# EAGLE design btn_0.3 (EAGLE 6.3)
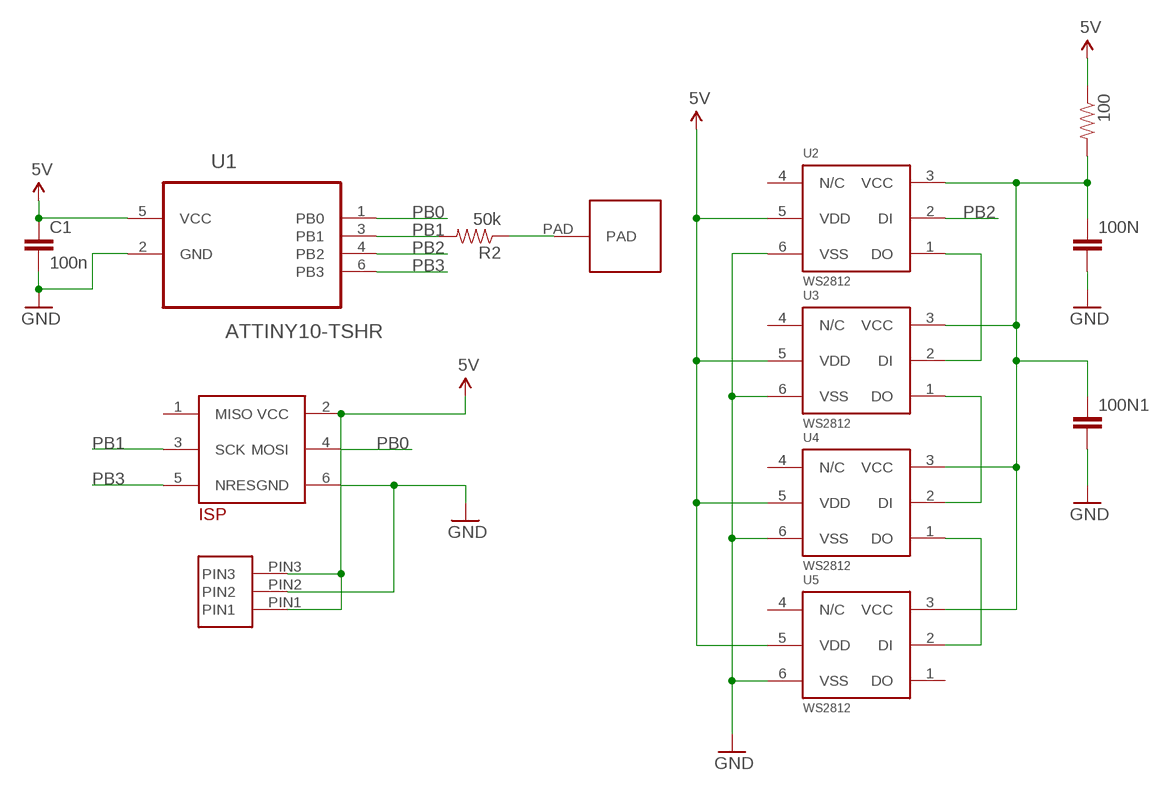
[diagram p0: schematic, sheet 1]

## Parts
100  RESISTOR0805-RES  [0805]
100N  CAP0805  [0805]
100N1  CAP0805  [0805]
C1  100n  CAP0805  [0805]
R2  50k  RESISTOR0805-RES  [0805]
U1  ATTINY10-TSHR  [SOT95P280X145-6N]
U2  WS2812  [PLCC6]
U3  WS2812  [PLCC6]
U4  WS2812  [PLCC6]
U5  WS2812  [PLCC6]
U$1  TB_ISPEDGE_2X3  [ISP_EDGE2X3]
U$2  TB_TOUCH_0.5INCH  [TOUCH_ROUND0.5INCH]
U$4  TB_EDGE3  [TB_EDGE3]

## Nets
5V [Power]: 100.1 C1.1 U1.5(VCC) U2.5(VDD) U3.5(VDD) U4.5(VDD) U5.5(VDD) U$1.2(VCC) U$4.PIN1 U$4.PIN3
GND [Power]: 100N1.2 100N.2 C1.2 U1.2(GND) U2.6(VSS) U3.6(VSS) U4.6(VSS) U5.6(VSS) U$1.6(GND) U$4.PIN2
N$1: R2.1 U$2.PAD
N$5: U2.1(DO) U3.2(DI)
N$6: U3.1(DO) U4.2(DI)
N$7: U4.1(DO) U5.2(DI)
N$8: 100.2 100N1.1 100N.1 U2.3(VCC) U3.3(VCC) U4.3(VCC) U5.3(VCC)
PB0: U1.1(PB0) U$1.4(MOSI)
PB1: R2.2 U1.3(PB1) U$1.3(SCK)
PB2: U1.4(PB2) U2.2(DI)
PB3: U1.6(PB3) U$1.5(NRES)
Unconnected: U2.4(N/C) U3.4(N/C) U4.4(N/C) U5.1(DO) U5.4(N/C) U$1.1(MISO)

## Library data of the parts
100 R2 = SparkFun-Resistors:RESISTOR: Resistor Basic schematic elements and footprints for 0603, 1206, and PTH resistors.
100N 100N1 C1 = SparkFun-Capacitors:CAP: Capacitor Standard 0603 ceramic capacitor, and 0.1" leaded capacitor.
U1 = Atmel_By_element14_Batch_1:ATTINY10-TSHR: 8-bit Microcontroller with In-System Programmable Flash; MPN: ATTINY10-TSHR; OC_FARNELL: 1748538; OC_NEWARK: 26R5645; PACKAGE: SOT-23-6; SUPPLIER: Atmel
U2-U5 = WS2812:WS2812: WS2812 Intelligent RGB LED
U$1 = tb_custom:TB_ISPEDGE_2X3: AVR-ISP connector an Platinenrand
U$2 = tb_custom:TB_TOUCH_0.5INCH
U$4 = tb_custom:TB_EDGE3: Lötverbinder für Platinenkante. Einseitig.

## Board
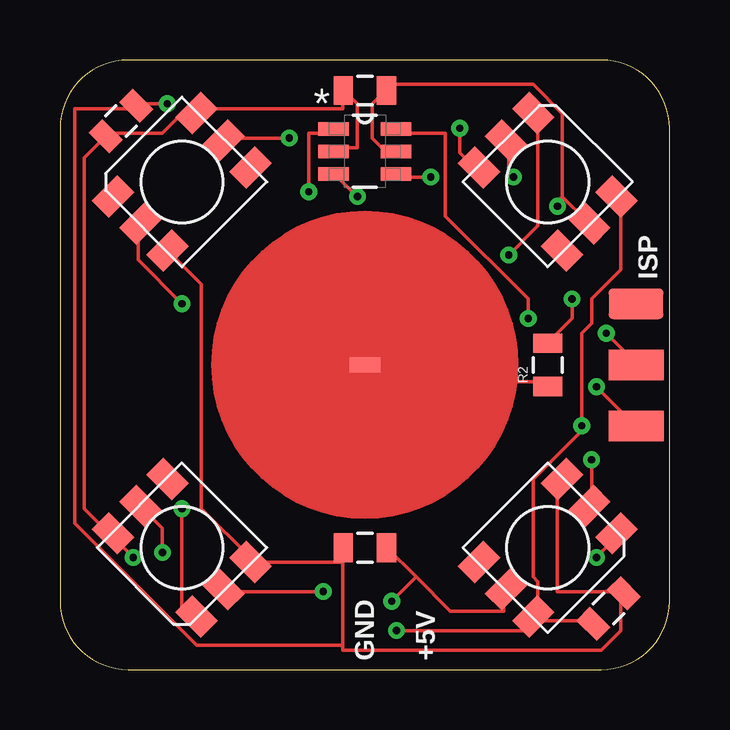
[diagram p1: board, top side]
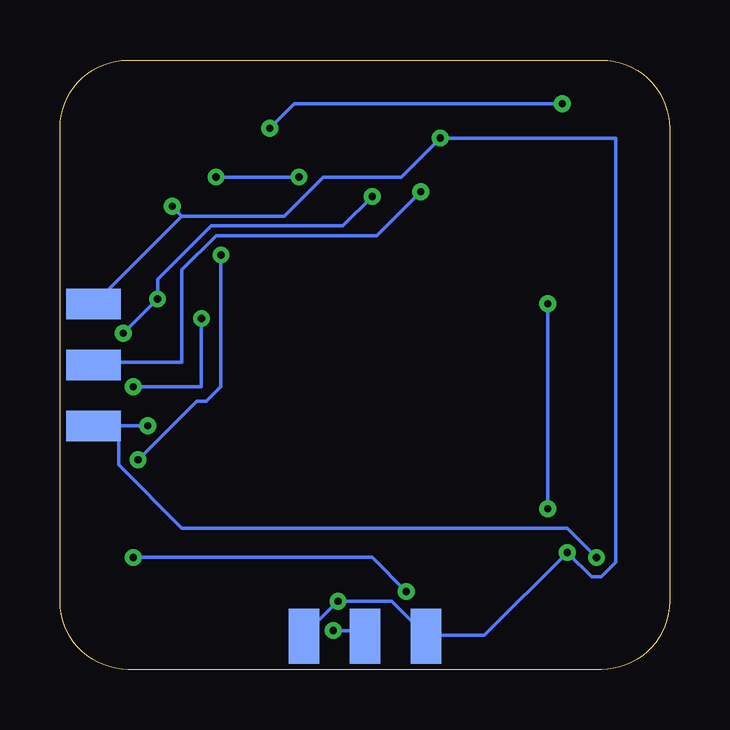
[diagram p2: board, bottom side, seen from below]

Size 25.4 x 25.4 mm. Coordinates in mm from the lower left corner, seen from the top.
Outline: 0,22.56 0,2.84 arc90 2.84,0 22.56,0 arc90 25.4,2.84 25.4,22.56 arc90 22.56,25.4 2.84,25.4 arc90 0,22.56
Copper layers (1*16): Top 0.035mm / dielectric 1.5mm / Bottom 0.035mm
Design rules "platinensammler_02": minimum track width 0.15mm, minimum drill 0.3mm, track to track 0.15mm, track to pad 0.15mm, pad to pad 0.15mm, via to via 0.15mm, smd to smd 0mil, copper to edge 0.2mm, drill to drill 0.2mm, minimum pad ring 0.2mm, minimum via ring 0.2mm, stop-mask expansion 4mil, vias tented up to drill 0.8mm, thermal gap 0.15mm

### Footprints (pad centres in the part's own frame; a part is rotated, then mirrored left to right if it is on the bottom)
0805 = smd 0.8 x 1.2: 1 -0.9,0; 2 0.9,0
SOT95P280X145-6N = smd 1.27 x 0.559: 1 -1.295,0.94; 2 -1.295,0; 3 -1.295,-0.94; 4 1.295,-0.94; 5 1.295,0; 6 1.295,0.94
PLCC6 = smd 1.5 x 1: 1 2.45,-1.6; 2 2.45,0; 3 2.45,1.6; 4 -2.45,1.6; 5 -2.45,0; 6 -2.45,-1.6
ISP_EDGE2X3 = smd 2.286 x 1.27: 1 -0.127,2.54; 3 -0.127,0; 5 -0.127,-2.54 | smd 2.286 x 1.27 bottom: 2 -0.127,2.54; 4 -0.127,0; 6 -0.127,-2.54
TOUCH_ROUND0.5INCH = smd 1.27 x 0.635: PAD 0,0
TB_EDGE3 = smd 2.286 x 1.27: PIN1 -0.127,2.54; PIN2 -0.127,0; PIN3 -0.127,-2.54

### Placement (x,y rotation side)
100  12.7,5.08 180 top
100N  22.86,2.54 225 top
100N1  2.54,22.86 225 top
C1  12.7,24.13 180 top
R2  20.32,12.7 90 top
U1  12.7,21.59 0 top
U2  20.32,20.32 135 top
U3  20.32,5.08 45 top
U4  5.08,5.08 315 top
U5  5.08,20.32 225 top
U$1  24.13,12.7 0 top
U$2  12.7,12.7 0 top
U$4  12.7,1.27 270 bottom

### Tracks (layer width: path | path; a pad name or v marks a point on that pad's centre or on a via)
5V  (via drill 0.3)
  Top 0.15: 14.83,3.86 16.26,2.44 18.49,2.44 18.49,3.25 U3.5 | 14.83,3.86 13.61,5.08 100.1 | v4.27,4.88 4.27,5.89 3.45,6.71 U4.5 | v13.82,2.85 14.83,3.86 | U1.5 13.82,21.74 13.41,21.74 13.01,22.15 13.01,23.57 13.41,23.98 C1.1 13.61,24.18 13.61,24.38 19.71,24.38 20.93,23.16 20.93,19.71 | 20.93,19.71 21.95,18.69 U2.5 | v9.55,22.15 6.91,22.15 U5.5 | 20.93,19.71 20.73,19.51 v20.73,19.3
  Bottom 0.15: 10.16,1.42 7.72,1.42 v4.27,4.88 3.25,3.86 2.85,3.86 2.23,4.47 2.23,22.15 v9.55,22.15 11.18,20.52 14.43,20.52 16.05,18.9 20.32,18.9 | 10.16,1.42 11.58,2.85 v13.82,2.85 15.24,1.42 U$4.PIN3 | 10.16,1.42 U$4.PIN1 | 20.32,18.9 23.98,15.24 U$1.2 | 20.32,18.9 v20.73,19.3
GND  (via drill 0.3)
  Top 0.15: U1.2 11.58,21.74 12.39,21.74 12.39,23.57 11.99,23.98 C1.2 11.79,23.98 11.79,23.37 5.69,23.37 U5.6 5.49,23.16 5.08,23.16 4.27,22.35 2.03,22.35 100N1.2 1.02,21.34 1.02,6.71 2.03,5.69 U4.6 2.23,5.49 v3.05,4.67 | 100N.2 22.15,2.03 19.91,2.03 U3.6 | v14.02,1.63 19.71,1.63 19.71,2.03 U3.6 | U2.6 23.37,19.71 23.37,16.66 22.15,15.44 22.15,14.43 21.74,14.02 v21.74,10.16 21.74,9.96 19.71,7.92 19.71,3.86 19.91,3.66 19.91,2.23 U3.6
  Bottom 0.15: v14.02,1.63 13.01,1.63 12.8,1.42 U$4.PIN2 | v21.74,10.16 22.96,10.16 | 22.96,10.16 U$1.6 | v3.05,4.67 4.27,5.89 20.32,5.89 22.96,8.53 22.96,10.16
N$1
  Top 0.15: 12.8,13.41 12.8,12.8 U$2.PAD 12.8,12.6 12.8,11.99 20.32,11.99 R2.1
N$5  (via drill 0.3)
  Top 0.15: v22.15,8.74 22.15,6.91 U3.2 | v18.69,17.27 19.91,18.49 19.91,23.16 U2.1
  Bottom 0.15: v22.15,8.74 19.71,11.18 19.3,11.18 18.69,11.79 v18.69,17.27
N$6  (via drill 0.3)
  Top 0.15: v10.97,3.25 6.91,3.25 U4.2 | v22.35,4.67 23.16,5.49 U3.1
  Bottom 0.15: v10.97,3.25 12.39,4.67 v22.35,4.67
N$7  (via drill 0.3)
  Top 0.15: v5.08,6.71 5.08,2.64 5.49,2.23 U4.1 | v5.08,15.24 3.25,17.07 3.25,18.49 U5.2
  Bottom 0.15: v5.08,15.24 v5.08,6.71
N$8  (via drill 0.3)
  Top 0.15: U3.3 20.73,7.92 20.73,3.25 23.37,3.25 100N.1 23.37,3.05 23.37,1.63 22.55,0.81 11.79,0.81 11.79,1.02 | 11.79,1.02 5.69,1.02 0.61,6.1 0.61,23.37 3.05,23.37 100N1.1 3.25,23.57 v4.47,23.57 | 11.79,4.47 11.79,5.08 100.2 | 11.79,4.47 11.79,1.02 | 11.79,4.47 8.13,4.47 U4.3 7.92,4.67 5.89,6.71 5.89,16.05 4.67,17.27 U5.3 | v16.66,22.55 16.66,21.54 17.27,20.93 U2.3
  Bottom 0.15: v16.66,22.55 15.65,23.57 v4.47,23.57
PB0  (via drill 0.3)
  Top 0.15: v10.36,19.91 10.36,22.35 11.38,22.35 U1.1
  Bottom 0.15: v10.36,19.91 12.19,18.09 18.9,18.09 20.32,16.66 20.32,12.8 23.98,12.8 U$1.4
PB1  (via drill 0.3)
  Top 0.15: v22.76,14.02 23.98,12.8 U$1.3 | v12.39,19.71 11.58,20.52 U1.3 | v21.34,15.44 21.34,14.63 20.32,13.61 R2.2
  Bottom 0.15: v22.76,14.02 v21.34,15.44 21.34,16.26 19.1,18.49 13.61,18.49 v12.39,19.71
PB2  (via drill 0.3)
  Top 0.15: v15.44,20.52 14.02,20.52 U1.4 | v18.9,20.52 18.69,20.73 18.69,21.95 U2.2
  Bottom 0.15: v18.9,20.52 v15.44,20.52
PB3  (via drill 0.3)
  Top 0.15: v19.51,14.63 19.51,15.44 16.05,18.9 16.05,22.35 14.02,22.35 U1.6 | v22.35,11.79 23.98,10.16 U$1.5
  Bottom 0.15: v19.51,14.63 19.51,11.79 v22.35,11.79

### Text on the board
tPlace: ISP | GND | +5V